# EAGLE schematic ambient_tag_v2 (EAGLE 7.6.0)
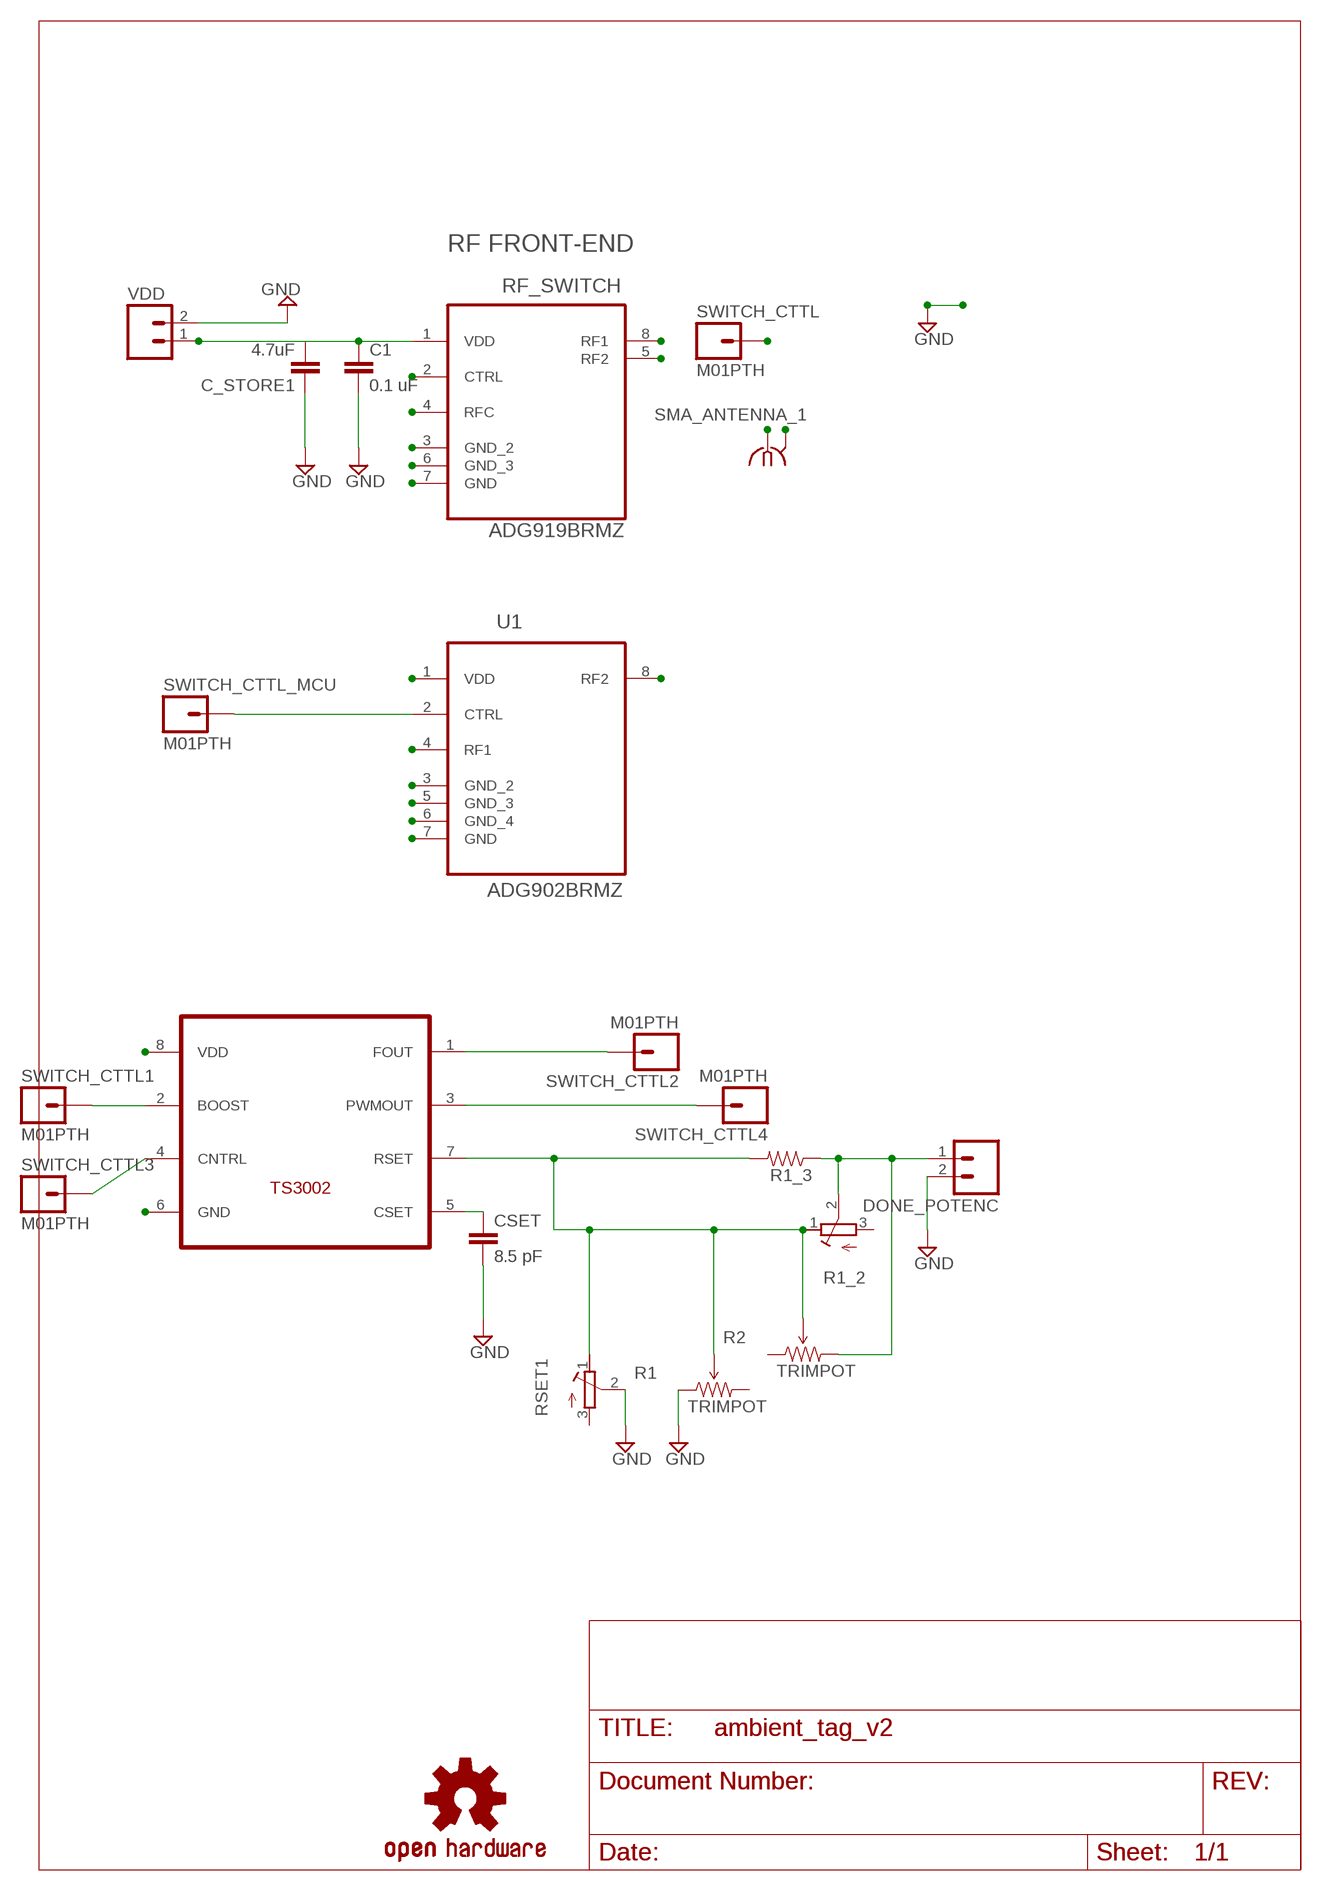
[diagram p0: schematic, sheet 1]

## Parts
C1  0.1 uF  CAP0603-CAP  [0603-CAP]
C_STORE1  4.7uF  1.0UF-25V-+80/-20(0805)  [0805]
CSET  8.5 pF  CAP0603-CAP  [0603-CAP]
DONE_POTENC  M02PTH  [1X02]
LOGO1  OSHW-LOGOL  [OSHW-LOGO-L]
R1  TRIMPOT  [3362U-2]
R1_2  R-TRIMM3314G  [RTRIM3314G]
R1_3  RESISTOR0603-RES  [0603-RES]
R2  TRIMPOT  [3362U-2]
RF_SWITCH  ADG919BRMZ  [SOP65P490X110-8N]
RSET1  R-TRIMM3314G  [RTRIM3314G]
SMA_ANTENNA_1  SMA-142-0701-881/886  [J502-ND-142-0701-881/886]
SWITCH_CTTL  M01PTH  [1X01]
SWITCH_CTTL1  M01PTH  [1X01]
SWITCH_CTTL2  M01PTH  [1X01]
SWITCH_CTTL3  M01PTH  [1X01]
SWITCH_CTTL4  M01PTH  [1X01]
SWITCH_CTTL_MCU  M01PTH  [1X01]
U1  ADG902BRMZ  [SOP65P490X110-8N]
U$1  TS3002  [TDFN22-8]
VDD  M02PTH  [1X02]

## Nets
CTRL: SWITCH_CTTL3.1 U$1.4(CNTRL)
GND: C1.2 C_STORE1.1 CSET.2 DONE_POTENC.2 R1.1(CCW) RF_SWITCH.3(GND_2) RF_SWITCH.6(GND_3) RF_SWITCH.7(GND) RSET1.2(S) U1.3(GND_2) U1.5(GND_3) U1.6(GND_4) U1.7(GND) U$1.6(GND) VDD.2
N$1: DONE_POTENC.1 R1_2.2(S) R1_3.1 R2.3(CW)
N$2: SWITCH_CTTL_MCU.1 U1.2(CTRL)
N$3: SWITCH_CTTL1.1 U$1.2(BOOST)
N$4: SWITCH_CTTL4.1 U$1.3(PWMOUT)
N$6: R1.2(WIPER) R1_2.1(E) R1_3.2 R2.2(WIPER) RSET1.1(E) U$1.7(RSET)
N$8: CSET.1 U$1.5(CSET)
RF1: RF_SWITCH.8(RF1)
RF2: RF_SWITCH.5(RF2) SMA_ANTENNA_1.G@1 SMA_ANTENNA_1.G@2 SMA_ANTENNA_1.G@3 SMA_ANTENNA_1.G@4
RFC: RF_SWITCH.4(RFC) SMA_ANTENNA_1.1
SWITCH_CTTL: RF_SWITCH.2(CTRL) SWITCH_CTTL.1 U1.8(RF2)
TIMER: SWITCH_CTTL2.1 U1.4(RF1) U$1.1(FOUT)
VDD_1.8V: C1.1 C_STORE1.2 RF_SWITCH.1(VDD) U1.1(VDD) U$1.8(VDD) VDD.1
Unconnected: R1.3(CW) R1_2.3(A) R2.1(CCW) RSET1.3(A)

## Notes on the sheet
- RF FRONT-END

## Library data of the parts
C1 CSET = SparkFun-Capacitors:CAP: Capacitor Standard 0603 ceramic capacitor, and 0.1" leaded capacitor.
C_STORE1 = SparkFun-Capacitors:1.0UF-25V-+80/-20(0805): CAP-11625; PROD_ID: CAP-11625; VALUE: 1.0uF
DONE_POTENC VDD = SparkFun:M02: Header 2 Standard 2-pin 0.1" header. Use with straight break away headers (SKU : PRT-00116), right angle break away headers (PRT-00553), swiss pins (PRT-00743), machine pins (PRT-00117), and female headers (PRT-00115). Molex polarized connector foot print use with SKU : PRT-08233 with associated crimp pins and housings.
LOGO1 = SparkFun-Aesthetics:OSHW-LOGO: Open Source Hardware Logo This logo indicates the piece of hardware it is found on incorporates a OSHW license and/or adheres to the definition of open source hardware found here: http://freedomdefined.org/OSHW
R1 R2 = SparkFun:TRIMPOT
R1_2 RSET1 = rcl:R-TRIMM: Trimm resistor
R1_3 = SparkFun-Passives:RESISTOR: Resistor Basic schematic elements and footprints for 0603, 1206, and PTH resistors.
RF_SWITCH = analog-devices-Phase-2:ADG919BRMZ: 1.65 V to 2.75 V, 2:1 Mux/SPDT; MPN: ADG919BRMZ; OC_FARNELL: 1346347; OC_NEWARK: 59K1711; PACKAGE: MSOP-8; SUPPLIER: Analog Devices
SMA_ANTENNA_1 = con-coax:SMA-: SMA 50 Ohm End Launch Jack Receptacle - Round Contact Johnson Components Source: www.johnsoncomponents.com .. J502-ND.pdf; MF: JOHNSON COMPONENTS; MPN: 142-0701-881; OC_FARNELL: 1608603; OC_NEWARK: 08B906
SWITCH_CTTL SWITCH_CTTL1-SWITCH_CTTL4 SWITCH_CTTL_MCU = SparkFun:M01: Header 1 Standard 1-pin 0.1" header. Use with straight break away headers (SKU : PRT-00116), right angle break away headers (PRT-00553), swiss pins (PRT-00743), machine pins (PRT-00117), and female headers (PRT-00115).
U1 = analog-devices-Phase-2:ADG902BRMZ: 1.65 V to 2.75 V, SPST Switches; MPN: ADG902BRMZ; OC_FARNELL: 1346345; OC_NEWARK: 59K1691; PACKAGE: MSOP-8; SUPPLIER: Analog Devices
U$1 = ts3002TDFN22_8pin:TS3002